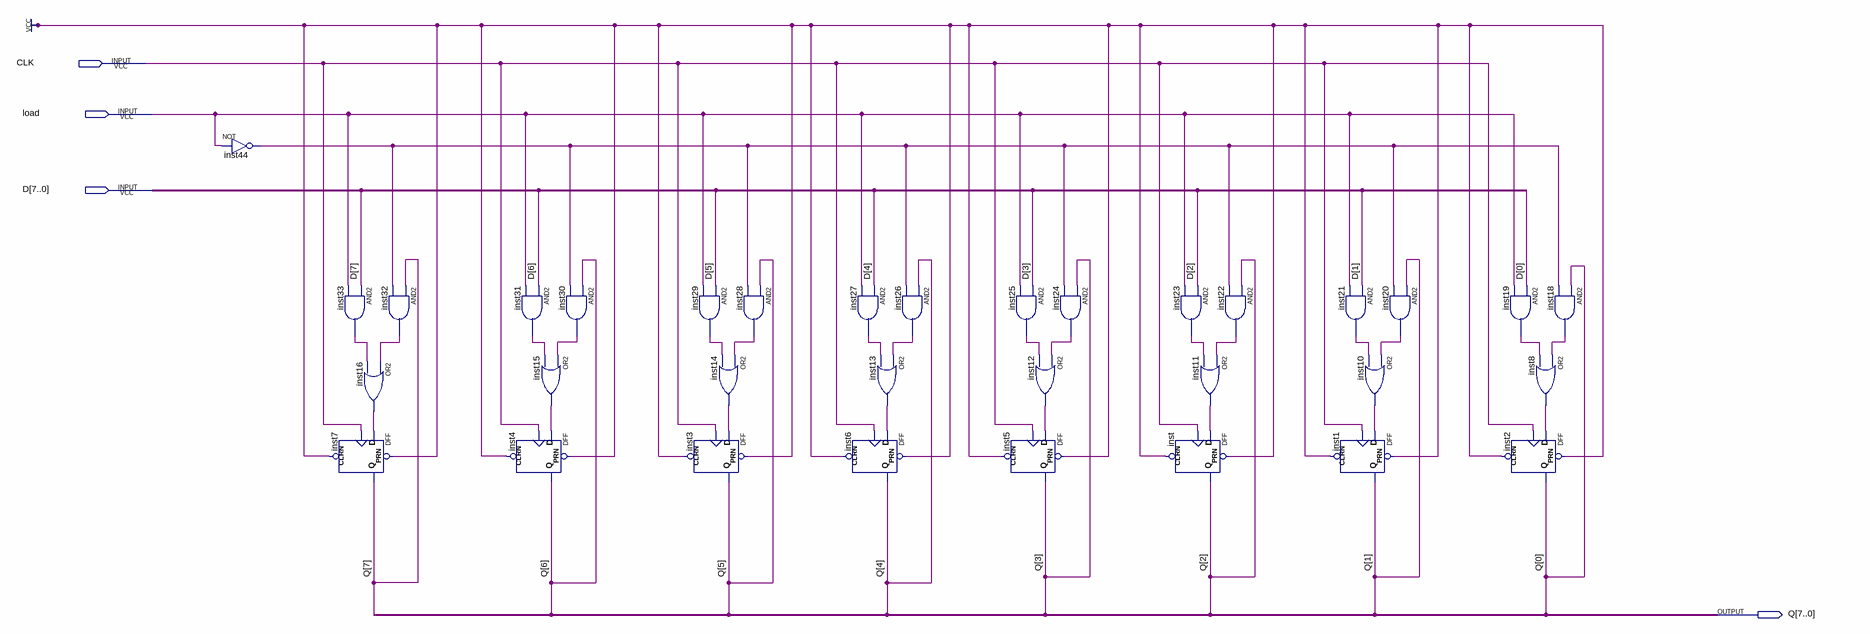
[diagram p0: schematic sheet]
// Quartus schematic neander_top.bdf as structural Verilog: 33 symbols, 4 pins
module neander_top (
  input  CLK,
  input  load,
  input  [7:0] D,
  output [7:0] Q
);

  wire inst8_out, inst10_out, inst11_out, inst12_out, inst13_out, inst14_out, inst15_out, inst16_out,
       inst18_out, inst19_out, inst20_out, inst21_out, inst22_out, inst23_out, inst24_out, inst25_out,
       inst26_out, inst27_out, inst28_out, inst29_out, inst30_out, inst31_out, inst32_out, inst33_out,
       inst44_out;

  not inst44 (inst44_out, load);
  and inst33 (inst33_out, D[7], load);
  or inst16 (inst16_out, inst32_out, inst33_out);
  DFF inst7 (.CLRN(1'b1), .CLK(CLK), .D(inst16_out), .PRN(1'b1), .Q(Q[7]));
  and inst32 (inst32_out, Q[7], inst44_out);
  and inst31 (inst31_out, D[6], load);
  DFF inst4 (.CLRN(1'b1), .CLK(CLK), .D(inst15_out), .PRN(1'b1), .Q(Q[6]));
  and inst30 (inst30_out, Q[6], inst44_out);
  or inst15 (inst15_out, inst30_out, inst31_out);
  and inst29 (inst29_out, D[5], load);
  or inst14 (inst14_out, inst28_out, inst29_out);
  DFF inst3 (.CLRN(1'b1), .CLK(CLK), .D(inst14_out), .PRN(1'b1), .Q(Q[5]));
  and inst28 (inst28_out, Q[5], inst44_out);
  and inst27 (inst27_out, D[4], load);
  or inst13 (inst13_out, inst26_out, inst27_out);
  DFF inst6 (.CLRN(1'b1), .CLK(CLK), .D(inst13_out), .PRN(1'b1), .Q(Q[4]));
  and inst26 (inst26_out, Q[4], inst44_out);
  and inst25 (inst25_out, D[3], load);
  DFF inst5 (.CLRN(1'b1), .CLK(CLK), .D(inst12_out), .PRN(1'b1), .Q(Q[3]));
  and inst24 (inst24_out, Q[3], inst44_out);
  or inst12 (inst12_out, inst24_out, inst25_out);
  and inst23 (inst23_out, D[2], load);
  DFF inst (.CLRN(1'b1), .CLK(CLK), .D(inst11_out), .PRN(1'b1), .Q(Q[2]));
  and inst22 (inst22_out, Q[2], inst44_out);
  or inst11 (inst11_out, inst22_out, inst23_out);
  and inst21 (inst21_out, D[1], load);
  or inst10 (inst10_out, inst20_out, inst21_out);
  DFF inst1 (.CLRN(1'b1), .CLK(CLK), .D(inst10_out), .PRN(1'b1), .Q(Q[1]));
  and inst20 (inst20_out, Q[1], inst44_out);
  and inst19 (inst19_out, D[0], load);
  or inst8 (inst8_out, inst18_out, inst19_out);
  DFF inst2 (.CLRN(1'b1), .CLK(CLK), .D(inst8_out), .PRN(1'b1), .Q(Q[0]));
  and inst18 (inst18_out, Q[0], inst44_out);
endmodule
